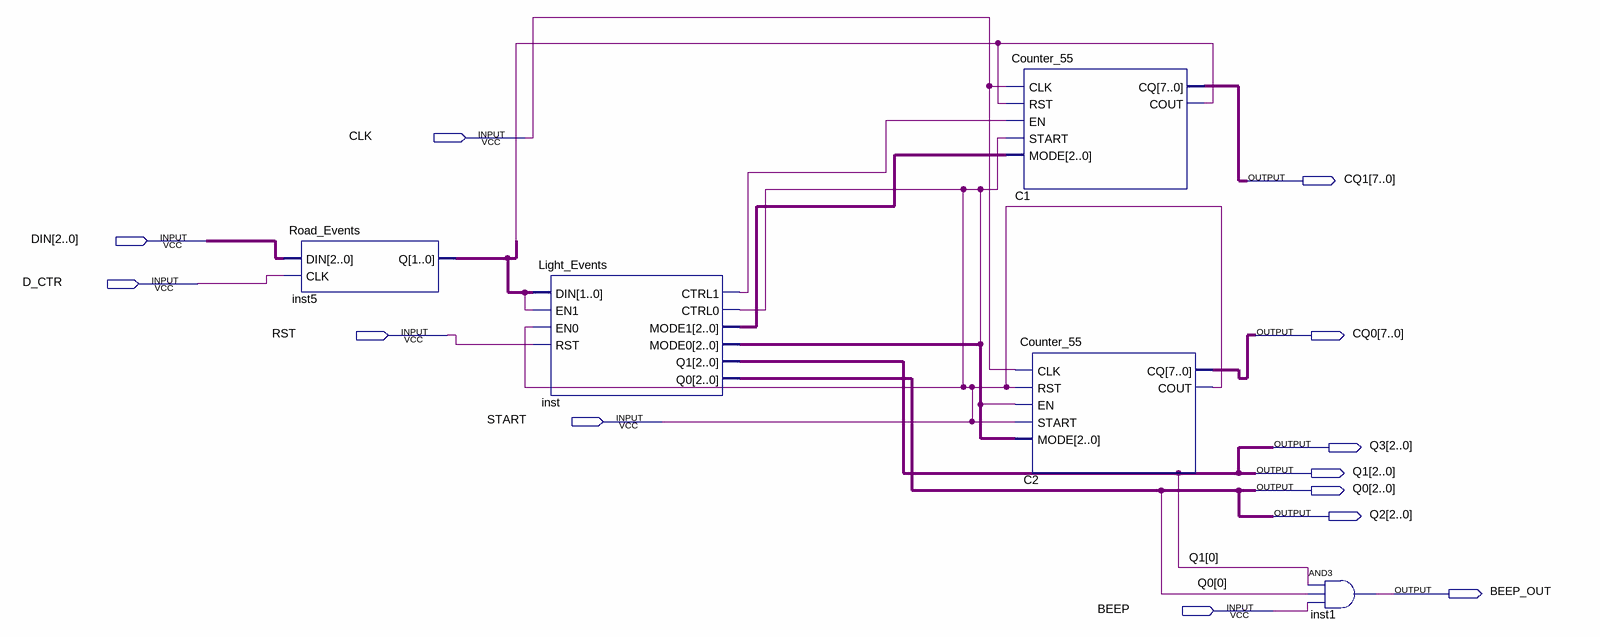
[diagram p0: schematic sheet]
// Quartus schematic Block_Design.bdf as structural Verilog: 5 symbols, 13 pins
module Block_Design (
  input  CLK,
  input  [2:0] DIN,
  input  D_CTR,
  input  RST,
  input  START,
  input  BEEP,
  output [7:0] CQ1,
  output [7:0] CQ0,
  output [2:0] Q3,
  output [2:0] Q1,
  output [2:0] Q0,
  output [2:0] Q2,
  output BEEP_OUT
);

  wire C1_cout, inst_ctrl1, undriven, undriven_2;
  wire [1:0] inst5_q;
  wire [2:0] inst_mode0, inst_mode1;

  Road_Events inst5 (.DIN(DIN), .CLK(D_CTR), .Q(inst5_q));
  Light_Events inst (
    .DIN(inst5_q), .EN1(undriven), .EN0(START), .RST(RST), .CTRL1(inst_ctrl1), .CTRL0(START),
    .MODE1(inst_mode1), .MODE0(inst_mode0), .Q1(Q1), .Q0(Q0));
  Counter_55 C1 (.CLK(CLK), .RST(C1_cout), .EN(inst_ctrl1), .START(START), .MODE(inst_mode1), .CQ(CQ1), .COUT(C1_cout));
  Counter_55 C2 (.CLK(CLK), .RST(START), .EN(undriven_2), .START(START), .MODE(inst_mode0), .CQ(CQ0), .COUT(START));
  and inst1 (BEEP_OUT, Q1[0], Q0[0], BEEP);

  assign Q2 = Q0;
  assign Q3 = Q1;
endmodule
